# EAGLE design SakuraIo (EAGLE 8.5.1)
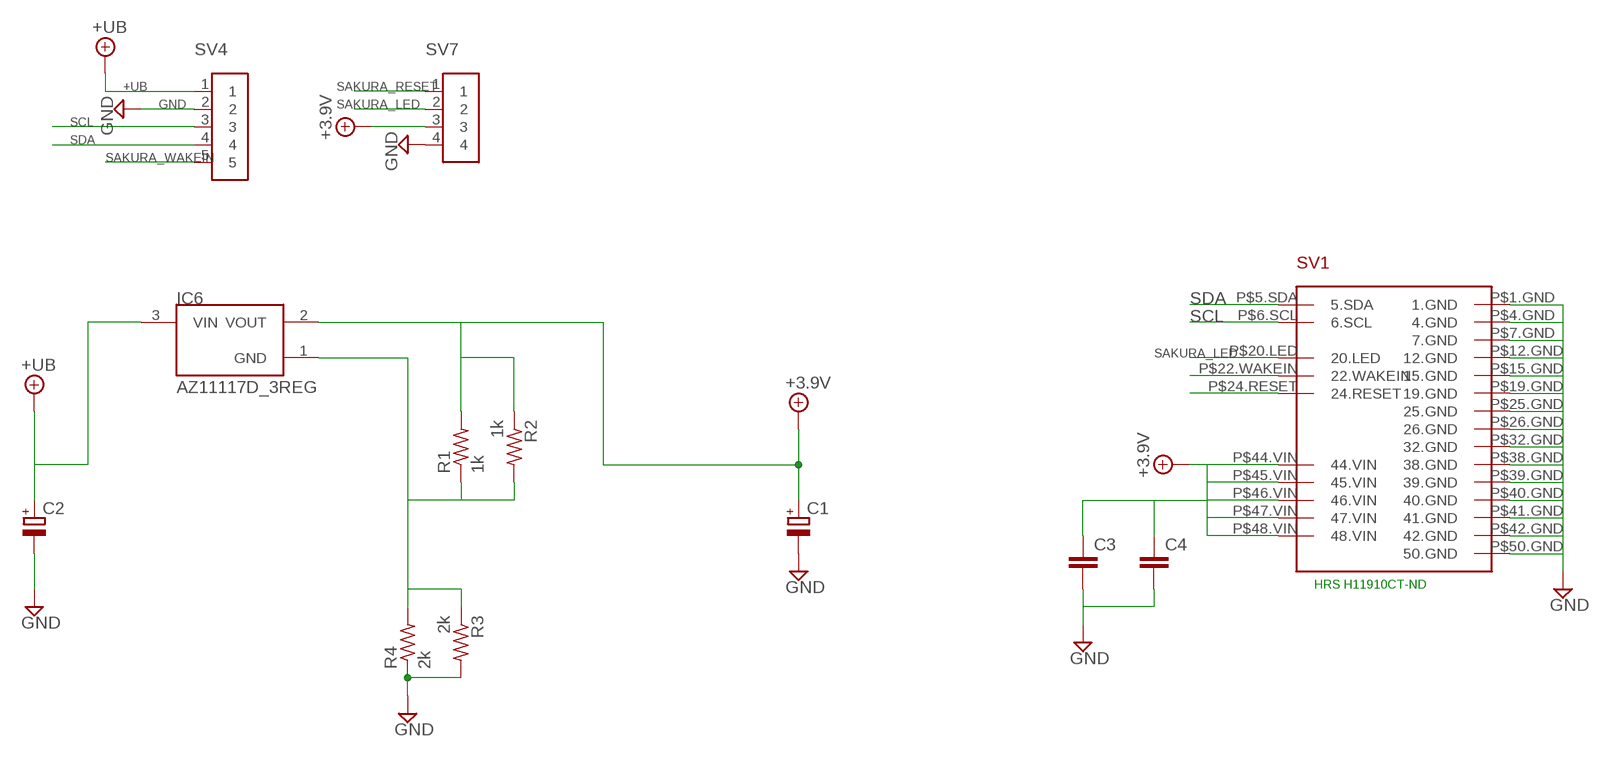
[diagram p0: schematic, sheet 1]

## Parts
C1  CPOL-EUE2,5-6E  [E2,5-6E]
C2  CPOL-EUE2,5-6E  [E2,5-6E]
C3  C-EUC0603  [C0603]
C4  C-EUC0603  [C0603]
IC6  AZ11117D_3REG  [TO252]
R1  1k  R-US_0204/7  [0204/7]
R2  1k  R-US_R0603  [R0603]
R3  2k  R-US_R0603  [R0603]
R4  2k  R-US_0204/7  [0204/7]
SV1  SAKURA-HRS-CONNECTOR50  [SAKURA-HRS-CONNECTOR50]
SV4  PINHEADER_5_2.54MM  [PINHEADER_5_2.54MM]
SV7  PINHEADER_4_2.54MM  [PINHEADER_4_2.54MM]

## Nets
+3.9V [pow]: C1.+ C3.1 C4.1 IC6.2(VOUT) R1.2 R2.1 SV1.P$44.VIN(44.VIN) SV1.P$45.VIN(45.VIN) SV1.P$46.VIN(46.VIN) SV1.P$47.VIN(47.VIN) SV1.P$48.VIN(48.VIN) SV7.3
+UB: C2.+ IC6.3(VIN) SV4.1
GND: C1.- C2.- C3.2 C4.2 R3.2 R4.1 SV1.P$1.GND(1.GND) SV1.P$4.GND(4.GND) SV1.P$7.GND(7.GND) SV1.P$12.GND(12.GND) SV1.P$15.GND(15.GND) SV1.P$19.GND(19.GND) SV1.P$25.GND(25.GND) SV1.P$26.GND(26.GND) SV1.P$32.GND(32.GND) SV1.P$38.GND(38.GND) SV1.P$39.GND(39.GND) SV1.P$40.GND(40.GND) SV1.P$41.GND(41.GND) SV1.P$42.GND(42.GND) SV1.P$50.GND(50.GND) SV4.2 SV7.4
N$1: IC6.1(GND) R1.1 R2.2 R3.1 R4.2
SAKURA_LED: SV1.P$20.LED(20.LED) SV7.2
SAKURA_RESET: SV1.P$24.RESET(24.RESET) SV7.1
SAKURA_WAKEIN: SV1.P$22.WAKEIN(22.WAKEIN) SV4.5
SCL: SV1.P$6.SCL(6.SCL) SV4.3
SDA: SV1.P$5.SDA(5.SDA) SV4.4

## Notes on the sheet
- HRS H11910CT-ND

## Library data of the parts
C1 C2 = rcl:CPOL-EU: POLARIZED CAPACITOR, European symbol
C3 C4 = rcl:C-EU: CAPACITOR, European symbol
IC6 = Akizuki:AZ11117D_3REG
R1 R4 = rcl:R-US_: RESISTOR, American symbol
R2 R3 = resistor:R-US_: RESISTOR, American symbol
SV1 = Amazon:SAKURA-HRS-CONNECTOR50
SV4 = Akizuki:PINHEADER_5_2.54MM
SV7 = Akizuki:PINHEADER_4_2.54MM

## Board
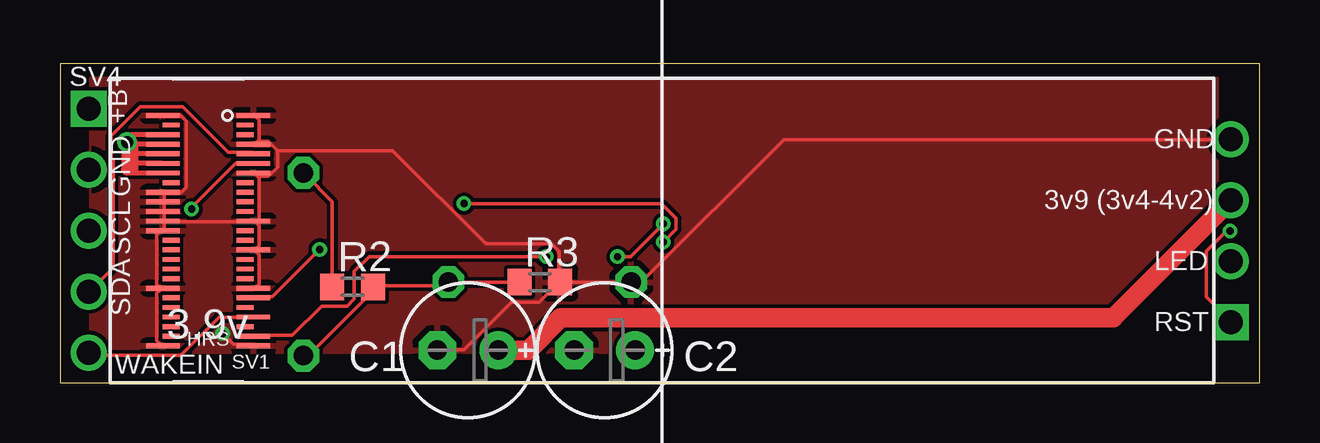
[diagram p1: board, top side]
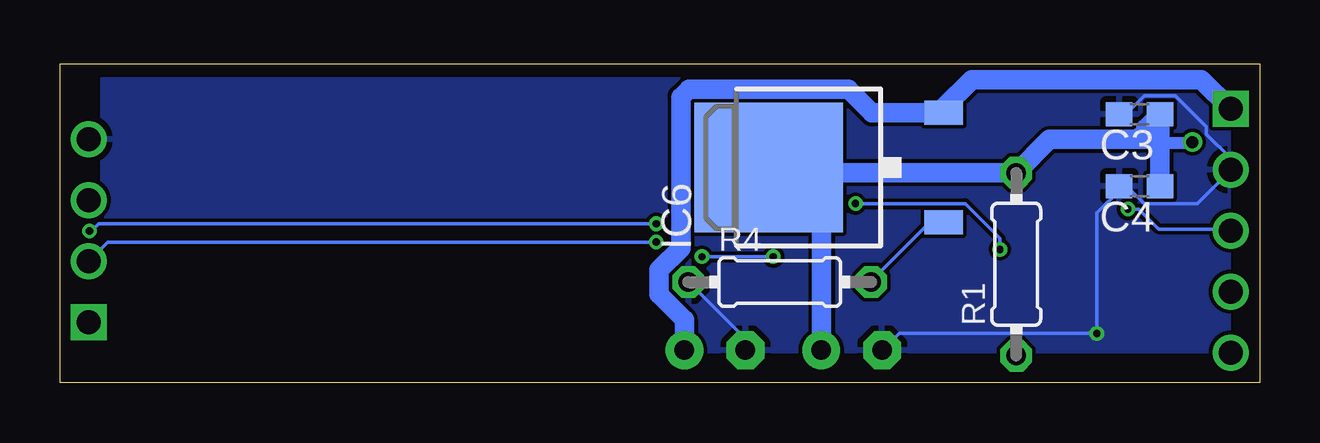
[diagram p2: board, bottom side, seen from below]

Size 50 x 13.3 mm. Coordinates in mm from the lower left corner, seen from the top.
Outline: 0,0 50,0 50,13.3 0,13.3 0,0
Copper layers (1*16): Top 0.035mm / dielectric 1.5mm / Bottom 0.035mm
Design rules "SeeedStudio_2layer_DRU_no_angle_20140221": minimum track width 6mil, minimum drill 12mil, track to track 6mil, track to pad 6mil, pad to pad 6mil, via to via 6mil, smd to smd 0mil, copper to edge 10mil, drill to drill 10mil, minimum pad ring 10mil, minimum via ring 6mil, stop-mask expansion 2mil, vias tented up to drill 100mil, thermal gap 10mil
vRestrict: area 25.5,-0.5 to 47.5,13.5

### Footprints (pad centres in the part's own frame; a part is rotated, then mirrored left to right if it is on the bottom)
E2,5-6E = drill 0.813 pad 1.575: + -1.27,0 | drill 0.813 pad 1.575 octagon: - 1.27,0
C0603 = smd 1.1 x 1: 1 -0.85,0; 2 0.85,0
TO252 = smd 1 x 1.6: 1 -2.28,-4.8; 3 2.28,-4.8 | smd 5.4 x 6.2: 2 0,2.5
0204/7 = drill 0.813 octagon: 1 -3.81,0; 2 3.81,0
R0603 = smd 1 x 1.1: 1 -0.85,0; 2 0.85,0
SAKURA-HRS-CONNECTOR50 = smd 0.2 x 1.4: P$1.GND -4.8,1.89; P$4.GND -3.6,1.89; P$5.SDA -3.2,1.89; P$6.SCL -2.8,1.89; P$7.GND -2.4,1.89; P$12.GND -0.4,1.89; P$15.GND 0.8,1.89; P$19.GND 2.4,1.89; P$20.LED 2.8,1.89; P$22.WAKEIN 3.6,1.89; P$24.RESET 4.4,1.89; P$25.GND 4.8,1.89; P$26.GND 4.8,-1.89; P$32.GND 2.4,-1.89; P$38.GND 0,-1.89; P$39.GND -0.4,-1.89; P$40.GND -0.8,-1.89; P$41.GND -1.2,-1.89; P$42.GND -1.6,-1.89; P$44.VIN -2.4,-1.89; P$45.VIN -2.8,-1.89; P$46.VIN -3.2,-1.89; P$47.VIN -3.6,-1.89; P$48.VIN -4,-1.89; P$50.GND -4.8,-1.89 | smd 0.2 x 0.7: P$2 -4.4,1.54; P$3 -4,1.54; P$8 -2,1.54; P$9 -1.6,1.54; P$10 -1.2,1.54; P$11 -0.8,1.54; P$13 0,1.54; P$14 0.4,1.54; P$16 1.2,1.54; P$17 1.6,1.54; P$18 2,1.54; P$21 3.2,1.54; P$23 4,1.54; P$27 4.4,-1.54; P$28 4,-1.54; P$29 3.6,-1.54; P$30 3.2,-1.54; P$31 2.8,-1.54; P$33 2,-1.54; P$34 1.6,-1.54; P$35 1.2,-1.54; P$36 0.8,-1.54; P$37 0.4,-1.54; P$43 -2,-1.54; P$49 -4.4,-1.54
PINHEADER_5_2.54MM = drill 1 square: 1 -5.08,0 | drill 1: 2 -2.54,0; 3 0,0; 4 2.54,0; 5 5.08,0
PINHEADER_4_2.54MM = drill 1 square: 1 -3.81,0 | drill 1: 2 -1.27,0; 3 1.27,0; 4 3.81,0

### Placement (x,y rotation side)
C1  17,1.36 180 top
C2  22.7,1.36 180 top
C3  5,11.2 180 bottom
C4  5,8.2 180 bottom
IC6  17.96,8.97 90 bottom
R1  10.14,4.94 90 bottom
R2  12.2,4 0 top
R3  20,4.2 0 top
R4  20,4.2 0 bottom
SV1  6.18,6.34 270 top
SV4  1.2,6.34 270 top
SV7  48.8,6.34 90 top

### Tracks (layer width: path | path; a pad name or v marks a point on that pad's centre or on a via)
+3.9V  (via drill 0.5)
  Top 0.152: R2.1 11.35,4.04 11.35,7.54 10.21,8.69 R1.2
  Top 0.2: SV1.P$48.VIN 3,10.34 3,10 3,9.94 | SV1.P$47.VIN 3,9.94 | SV1.P$46.VIN 3,9.54 3,9.94 | SV1.P$45.VIN 3,9.14 3,8.9 | SV1.P$44.VIN 2.79,8.74 2.79,8.9
  Top 0.508: v2.79,10.03 2.79,8.9 3,8.9 3,10
  Top 0.813: C1.+ 19.53,1.36 20.87,2.71 43.9,2.71 SV7.3
  Bottom 0.508: 5.07,10.14 5.07,10 4.15,10 2.79,10 v2.79,10.03
  Bottom 0.813: IC6.2 20.24,8.75 | 20.24,8.75 18.27,6.78 C1.+ | 20.24,8.75 R1.2 8.75,10.14 5.07,10.14 4.74,10.47 4.74,10.61 C3.1 4.15,10 C4.1
+UB
  Bottom 0.813: SV4.1 2.42,12.64 12,12.64 13.16,11.48 IC6.3 16.15,11.25 17.13,12.23 23.79,12.23 24.12,11.9 24.12,5.62 25.03,4.71 25.03,3.69 23.97,2.64 C2.+
GND  (via drill 0.3)
  Top 0.152: v6.78,2.06 7.24,1.6 8,1.6 SV1.P$25.GND | 8.27,10.1 8.31,10.13 8.31,10.97 8.08,11.2 SV1.P$1.GND | 8.27,10.1 8.15,9.98 8.08,9.98 SV1.P$4.GND | SV1.P$19.GND 8.08,3.96 8.15,3.96 8.31,4.12 8.31,5.33 8.08,5.56 SV1.P$15.GND 8.15,5.56 8.31,5.71 8.31,6.55 8.27,6.59 | 8.27,6.59 8.15,6.71 8.08,6.71 SV1.P$12.GND 8,6.71 4.42,6.71 SV1.P$39.GND | 8.27,8.57 8.31,8.53 8.31,6.63 8.27,6.59 | 8.27,8.57 8.15,8.69 8.08,8.69 SV1.P$7.GND | 9.07,9.68 8.69,10.06 8.31,10.06 8.27,10.1 | 9.07,9.68 9.07,8.99 8.69,8.61 8.31,8.61 8.27,8.57 | SV1.P$26.GND 4.27,1.6 4.19,1.6 4.04,1.75 4.04,3.73 4.27,3.96 SV1.P$32.GND 4.19,3.96 4.04,4.12 4.04,6.17 4.27,6.4 SV1.P$38.GND 4.34,6.4 4.34,6.71 SV1.P$39.GND | SV1.P$50.GND 4.34,11.12 5.03,11.12 5.26,10.9 5.26,8.15 5.03,7.92 4.42,7.92 SV1.P$42.GND 4.34,7.92 4.34,7.54 SV1.P$41.GND 4.34,7.47 4.34,7.16 SV1.P$40.GND 4.34,7.09 4.34,6.78 SV1.P$39.GND | R3.2 20.88,4.19 23.77,4.19 R4.1 23.85,4.27 24.31,4.27 30.18,10.13 48.77,10.13 SV7.4 | C1.- 15.77,1.37 16.84,1.37 18.82,3.35 19.96,3.35 20.8,4.19 R3.2 | 9.07,9.68 13.87,9.68 17.75,5.79 20.5,5.79 20.8,5.49 20.8,4.27 R3.2
  Bottom 0.152: C3.2 5.79,11.2 5.56,11.2 4.8,11.96 3.5,11.96 2.21,10.67 2.21,10.36 1.22,9.37 1.22,8.91 SV4.2 1.22,8.84 2.59,7.47 4.8,7.47 5.49,8.15 5.79,8.15 C4.2 5.79,8.08 6.78,7.09 v6.78,2.06 15.01,2.06 15.7,1.37 C1.- | C2.- 21.49,1.37 21.49,1.91 23.77,4.19 R4.1
  pour Bottom: 1.27,12.7 1.27,1.27 48.26,1.27 48.26,12.7
  pour Top: 1.27,12.7 1.27,1.27 48.26,1.27 48.26,12.7
N$1
  Top 0.152: R3.1 19.13,4.19 16.23,4.19 R4.2 16.15,4.19 16,4.04 13.11,4.04 R2.2 13.03,3.96 13.03,3.81 10.36,1.14 10.21,1.14 R1.1
  Bottom 0.152: IC6.1 13.18,6.63 13.79,6.63 16.15,4.27 R4.2
SAKURA_LED  (via drill 0.3)
  Top 0.152: v10.82,5.56 8.84,3.58 8.08,3.58 SV1.P$20.LED | v16.84,7.47 25.07,7.47 25.68,6.86 25.68,6.4 v25.15,5.87
  Bottom 0.152: v10.82,5.56 10.82,6.02 12.27,7.47 v16.84,7.47 | v25.15,5.87 48.01,5.87 48.77,5.11 SV7.2
SAKURA_RESET  (via drill 0.3)
  Top 0.152: v20.27,5.26 12.88,5.26 12.27,4.65 12.27,3.5 11.96,3.2 10.9,3.2 9.68,1.98 8.08,1.98 SV1.P$24.RESET | v23.24,5.26 23.77,5.26 v25.15,6.63 | v48.77,6.33 48.62,6.33 47.78,5.49 47.78,3.58 48.77,2.59 SV7.1
  Bottom 0.152: v23.24,5.26 v20.27,5.26 | v25.15,6.63 48.39,6.63 48.69,6.33 v48.77,6.33
SAKURA_WAKEIN
  Top 0.152: SV1.P$22.WAKEIN 8,2.74 6.63,2.74 5.03,1.14 1.29,1.14 1.22,1.22 SV4.5
SCL  (via drill 0.3)
  Top 0.152: v5.49,7.24 5.49,7.32 7.32,9.14 8,9.14 SV1.P$6.SCL
  Bottom 0.152: v5.49,7.24 5.03,7.24 4.19,6.4 1.22,6.4 SV4.3
SDA
  Top 0.152: SV1.P$5.SDA 8,9.6 7.01,9.6 5.11,11.51 3.35,11.51 2.13,10.29 2.13,9.37 2.21,9.3 2.21,4.8 1.22,3.81 SV4.4

### Text on the board
tPlace: +B | GND | GND | 3v9 (3v4-4v2) | SCL | LED | SDA | RST | WAKEIN
tNames: 3.9v